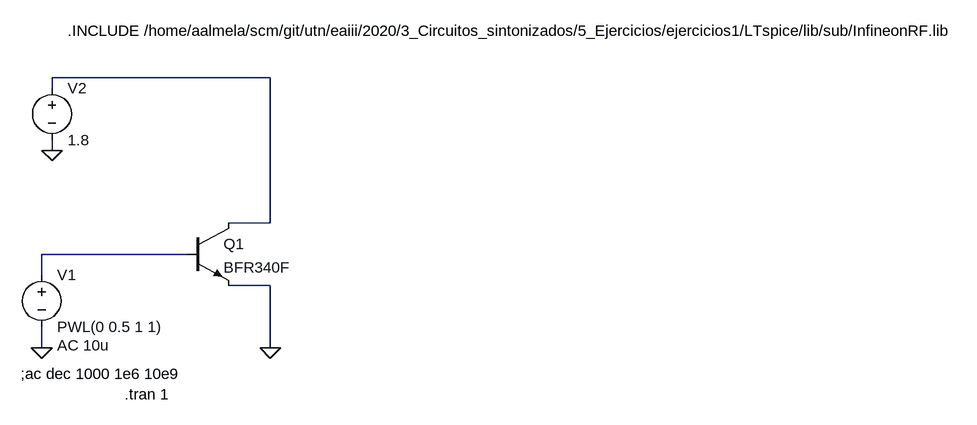
[diagram p0: schematic gummel.asc]
gummel.asc, the LTspice schematic file:
Version 4
SHEET 1 1148 680
WIRE -96 -80 -432 -80
WIRE -432 -64 -432 -80
WIRE -432 32 -432 16
WIRE -96 144 -96 -80
WIRE -96 144 -160 144
WIRE -224 192 -448 192
WIRE -448 224 -448 192
WIRE -96 240 -160 240
WIRE -448 336 -448 304
WIRE -96 336 -96 240
FLAG -448 336 0
FLAG -432 32 0
FLAG -96 336 0
SYMBOL voltage -448 208 R0
WINDOW 123 24 124 Left 2
WINDOW 39 0 0 Left 0
SYMATTR Value2 AC 10u
SYMATTR InstName V1
SYMATTR Value PWL(0 0.5 1 1)
SYMBOL voltage -432 -80 R0
WINDOW 123 0 0 Left 0
WINDOW 39 0 0 Left 0
SYMATTR InstName V2
SYMATTR Value 1.8
SYMBOL npn -224 144 R0
SYMATTR InstName Q1
SYMATTR Value BFR340F
SYMATTR Prefix X
TEXT -480 376 Left 2 !;ac dec 1000 1e6 10e9
TEXT -408 -152 Left 2 !.INCLUDE /home/aalmela/scm/git/utn/eaiii/2020/3_Circuitos_sintonizados/5_Ejercicios/ejercicios1/LTspice/lib/sub/InfineonRF.lib
TEXT -320 408 Left 2 !.tran 1

The netlist it stands for:
* gummel.asc
V1 N002 0 PWL(0 0.5 1 1) AC 10u
V2 N001 0 1.8
XQ1 N001 N002 0 BFR340F  ; pins C B E
;ac dec 1000 1e6 10e9
.INCLUDE /home/aalmela/scm/git/utn/eaiii/2020/3_Circuitos_sintonizados/5_Ejercicios/ejercicios1/LTspice/lib/sub/InfineonRF.lib
.tran 1
.backanno
.end